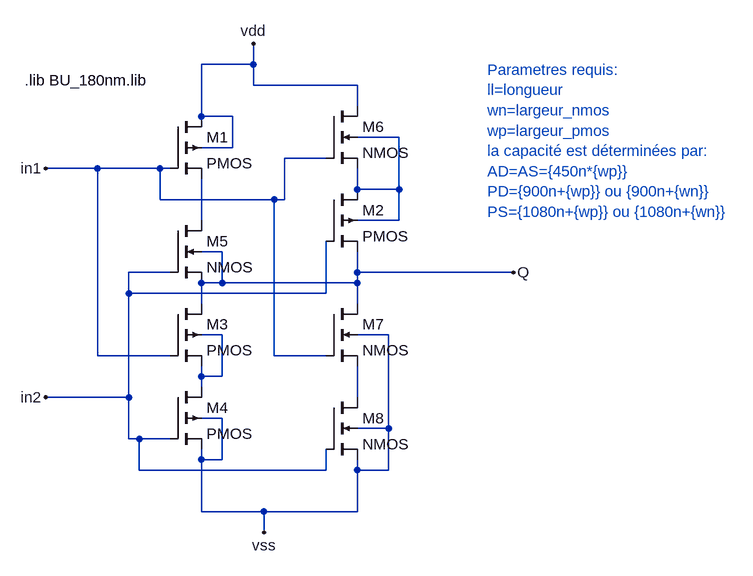
[diagram p0: schematic xor.asc]
xor.asc, the LTspice schematic file:
Version 4
SHEET 1 1268 852
WIRE 448 48 448 16
WIRE 448 48 368 48
WIRE 448 80 448 48
WIRE 608 80 448 80
WIRE 608 112 608 80
WIRE 368 128 368 48
WIRE 416 128 368 128
WIRE 672 160 608 160
WIRE 416 176 416 128
WIRE 416 176 368 176
WIRE 560 192 496 192
WIRE 208 208 128 208
WIRE 304 208 208 208
WIRE 320 208 304 208
WIRE 608 240 608 208
WIRE 672 240 672 160
WIRE 672 240 608 240
WIRE 304 256 304 208
WIRE 480 256 304 256
WIRE 496 256 496 192
WIRE 496 256 480 256
WIRE 368 288 368 224
WIRE 672 288 672 240
WIRE 672 288 608 288
WIRE 400 336 368 336
WIRE 320 368 256 368
WIRE 608 368 608 336
WIRE 848 368 608 368
WIRE 400 384 400 336
WIRE 400 384 368 384
WIRE 608 384 608 368
WIRE 608 384 400 384
WIRE 256 400 256 368
WIRE 560 400 560 320
WIRE 560 400 256 400
WIRE 368 416 368 384
WIRE 608 416 608 384
WIRE 400 464 368 464
WIRE 656 464 608 464
WIRE 208 496 208 208
WIRE 320 496 208 496
WIRE 480 496 480 256
WIRE 560 496 480 496
WIRE 368 528 368 512
WIRE 400 528 400 464
WIRE 400 528 368 528
WIRE 368 544 368 528
WIRE 256 560 256 400
WIRE 256 560 128 560
WIRE 608 560 608 512
WIRE 400 592 368 592
WIRE 656 608 656 464
WIRE 656 608 608 608
WIRE 256 624 256 560
WIRE 272 624 256 624
WIRE 320 624 272 624
WIRE 368 656 368 640
WIRE 400 656 400 592
WIRE 400 656 368 656
WIRE 272 672 272 624
WIRE 560 672 560 640
WIRE 560 672 272 672
WIRE 608 672 608 656
WIRE 656 672 656 608
WIRE 656 672 608 672
WIRE 368 736 368 656
WIRE 464 736 368 736
WIRE 608 736 608 672
WIRE 608 736 464 736
WIRE 464 768 464 736
FLAG 128 208 in1
FLAG 128 560 in2
FLAG 464 768 vss
FLAG 448 16 vdd
FLAG 848 368 Q
SYMBOL pmos4 320 128 R0
SYMATTR InstName M1
SYMATTR Value2 l={ll} w={wp} ad={450n*{wp}} as={450n*{wp}} pd={900n+{wp}} ps={1080n+{wp}}
SYMBOL pmos4 560 240 R0
SYMATTR InstName M2
SYMATTR Value2 l={ll} w={wp} ad={450n*{wp}} as={450n*{wp}} pd={900n+{wp}} ps={1080n+{wp}}
SYMBOL pmos4 320 416 R0
SYMATTR InstName M3
SYMATTR Value2 l={ll} w={wp} ad={450n*{wp}} as={450n*{wp}} pd={900n+{wp}} ps={1080n+{wp}}
SYMBOL pmos4 320 544 R0
SYMATTR InstName M4
SYMATTR Value2 l={ll} w={wp} ad={450n*{wp}} as={450n*{wp}} pd={900n+{wp}} ps={1080n+{wp}}
SYMBOL nmos4 320 288 R0
SYMATTR InstName M5
SYMATTR Value2 l={ll} w={wn} ad={450n*{wn}} as={450n*{wn}} pd={900n+{wn}} ps={1080n+{wn}}
SYMBOL nmos4 560 112 R0
SYMATTR InstName M6
SYMATTR Value2 l={ll} w={wn} ad={450n*{wn}} as={450n*{wn}} pd={900n+{wn}} ps={1080n+{wn}}
SYMBOL nmos4 560 416 R0
SYMATTR InstName M7
SYMATTR Value2 l={ll} w={wn} ad={450n*{wn}} as={450n*{wn}} pd={900n+{wn}} ps={1080n+{wn}}
SYMBOL nmos4 560 560 R0
SYMATTR InstName M8
SYMATTR Value2 l={ll} w={wn} ad={450n*{wn}} as={450n*{wn}} pd={900n+{wn}} ps={1080n+{wn}}
TEXT 96 72 Left 2 !.lib BU_180nm.lib
TEXT 808 56 Left 2 ;Parametres requis: \nll=longueur \nwn=largeur_nmos \nwp=largeur_pmos\nla capacité est déterminées par:\nAD=AS={450n*{wp}}\nPD={900n+{wp}} ou {900n+{wn}}\nPS={1080n+{wp}} ou {1080n+{wn}}

The netlist it stands for:
* xor.asc
M1 vdd in1 N002 vdd PMOS l={ll} w={wp} ad={450n*{wp}} as={450n*{wp}} pd={900n+{wp}} ps={1080n+{wp}}
M2 N001 in2 Q N001 PMOS l={ll} w={wp} ad={450n*{wp}} as={450n*{wp}} pd={900n+{wp}} ps={1080n+{wp}}
M3 Q in1 N003 N003 PMOS l={ll} w={wp} ad={450n*{wp}} as={450n*{wp}} pd={900n+{wp}} ps={1080n+{wp}}
M4 N003 in2 vss vss PMOS l={ll} w={wp} ad={450n*{wp}} as={450n*{wp}} pd={900n+{wp}} ps={1080n+{wp}}
M5 N002 in2 Q Q NMOS l={ll} w={wn} ad={450n*{wn}} as={450n*{wn}} pd={900n+{wn}} ps={1080n+{wn}}
M6 vdd in1 N001 N001 NMOS l={ll} w={wn} ad={450n*{wn}} as={450n*{wn}} pd={900n+{wn}} ps={1080n+{wn}}
M7 Q in1 N004 vss NMOS l={ll} w={wn} ad={450n*{wn}} as={450n*{wn}} pd={900n+{wn}} ps={1080n+{wn}}
M8 N004 in2 vss vss NMOS l={ll} w={wn} ad={450n*{wn}} as={450n*{wn}} pd={900n+{wn}} ps={1080n+{wn}}
.model NMOS NMOS
.model PMOS PMOS
.lib standard.mos
.lib BU_180nm.lib
* Parametres requis:
* ll=longueur
* wn=largeur_nmos
* wp=largeur_pmos
* la capacité est déterminées par:
* AD=AS={450n*{wp}}
* PD={900n+{wp}} ou {900n+{wn}}
* PS={1080n+{wp}} ou {1080n+{wn}}
.backanno
.end